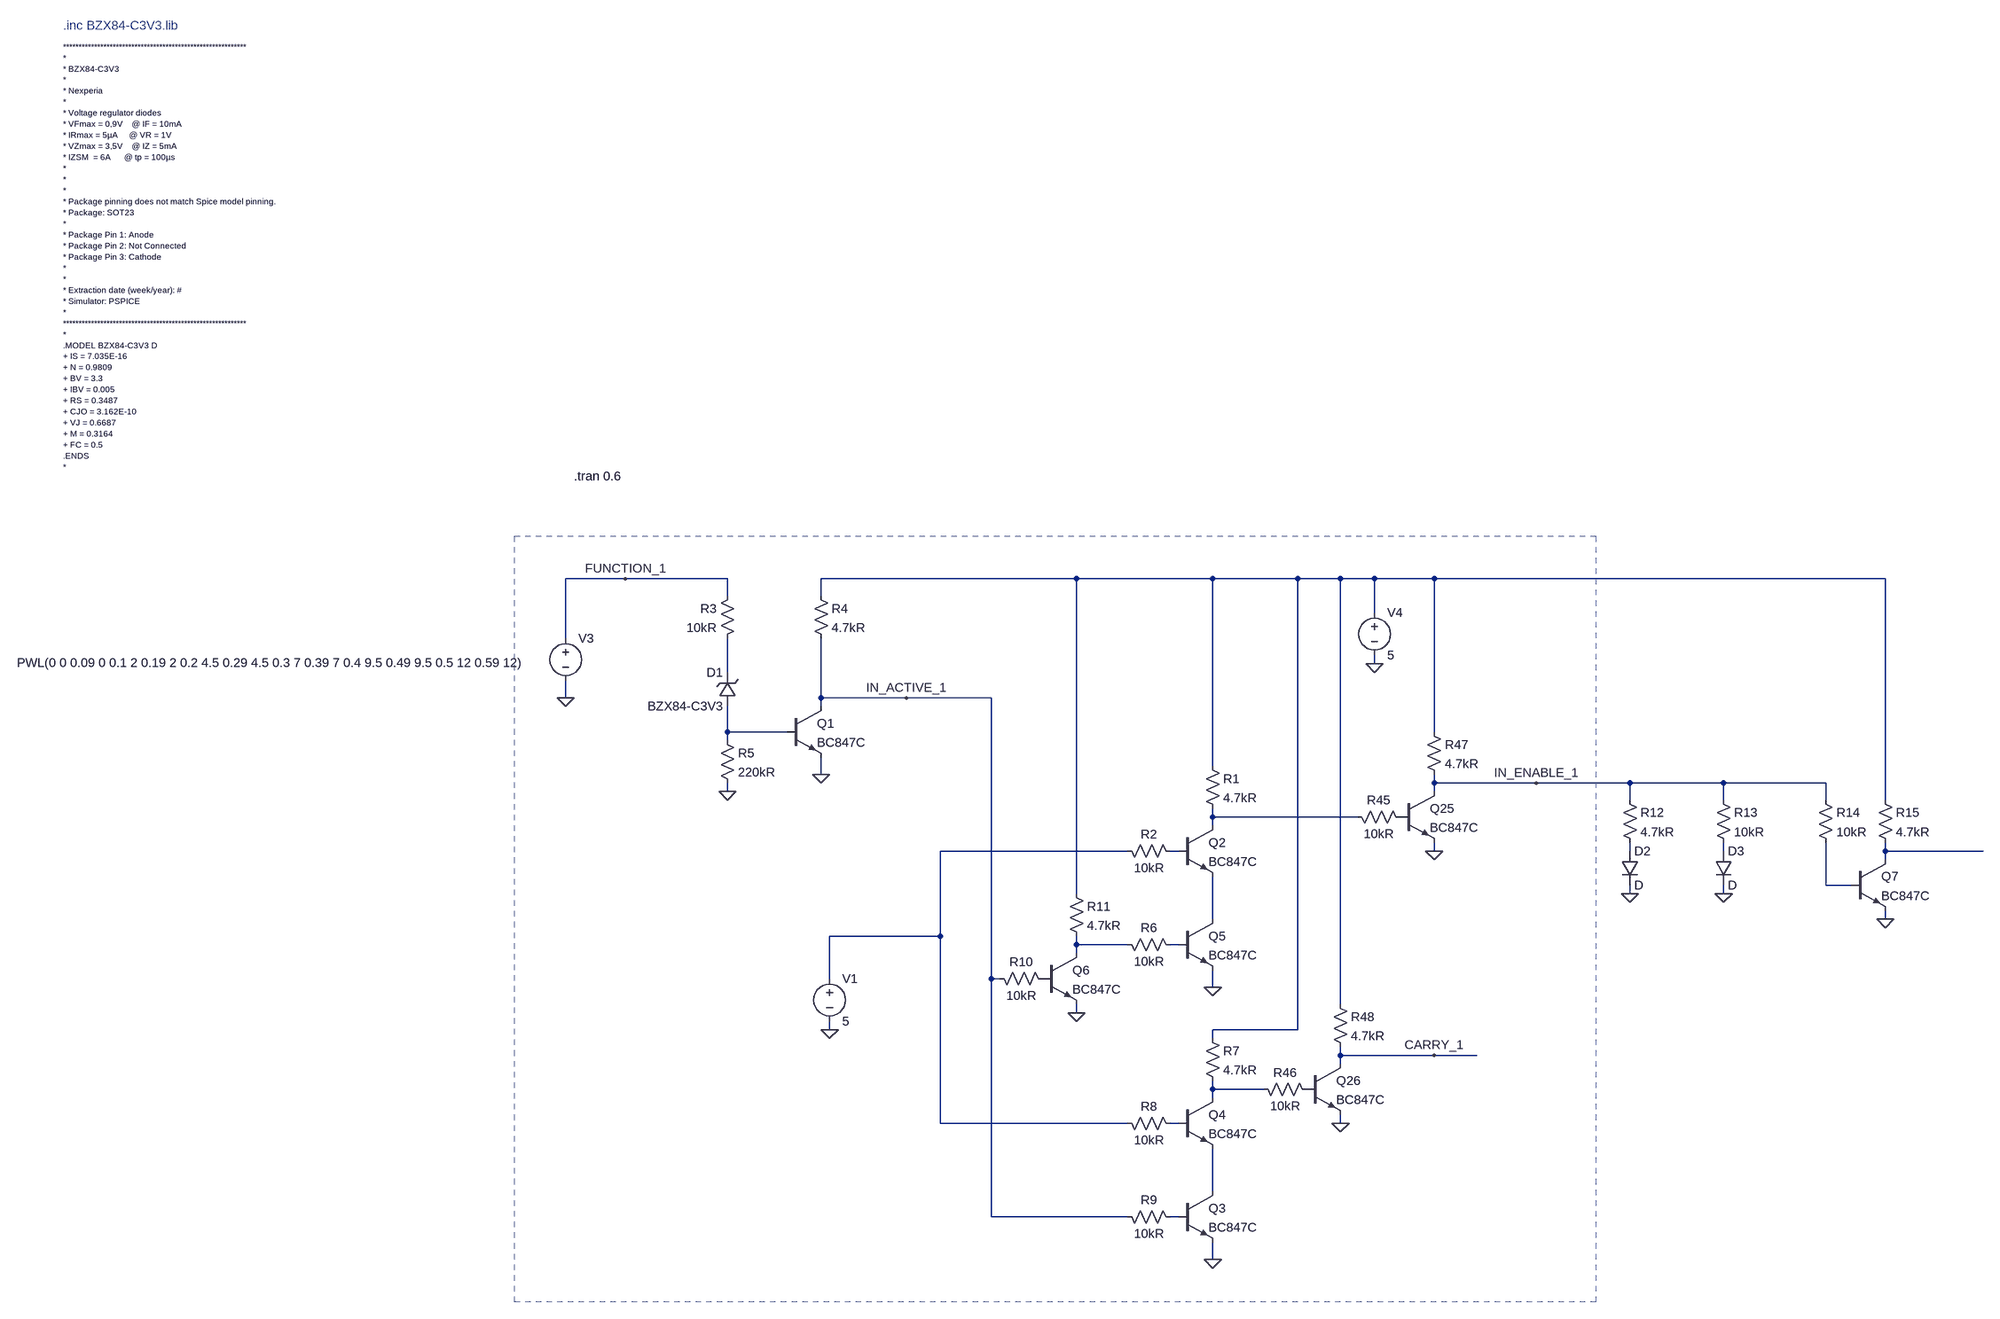
[diagram p0: schematic Source_selection.asc]
Source_selection.asc, the LTspice schematic file:
Version 4
SHEET 1 2756 6068
WIRE 160 -592 48 -592
WIRE 352 -592 160 -592
WIRE 1008 -592 528 -592
WIRE 1264 -592 1008 -592
WIRE 1424 -592 1264 -592
WIRE 1504 -592 1424 -592
WIRE 1568 -592 1504 -592
WIRE 1680 -592 1568 -592
WIRE 2528 -592 1680 -592
WIRE 352 -560 352 -592
WIRE 528 -560 528 -592
WIRE 1568 -528 1568 -592
WIRE 48 -480 48 -592
WIRE 1568 -432 1568 -448
WIRE 352 -416 352 -480
WIRE 48 -368 48 -400
WIRE 528 -368 528 -480
WIRE 688 -368 528 -368
WIRE 848 -368 688 -368
WIRE 528 -352 528 -368
WIRE 352 -304 352 -352
WIRE 464 -304 352 -304
WIRE 1680 -304 1680 -592
WIRE 352 -288 352 -304
WIRE 1264 -240 1264 -592
WIRE 528 -224 528 -256
WIRE 1680 -208 1680 -224
WIRE 1872 -208 1680 -208
WIRE 2048 -208 1872 -208
WIRE 2224 -208 2048 -208
WIRE 2416 -208 2224 -208
WIRE 352 -192 352 -208
WIRE 1680 -192 1680 -208
WIRE 2048 -176 2048 -208
WIRE 2224 -176 2224 -208
WIRE 2416 -176 2416 -208
WIRE 2528 -176 2528 -592
WIRE 1264 -144 1264 -160
WIRE 1536 -144 1264 -144
WIRE 1264 -128 1264 -144
WIRE 1104 -80 752 -80
WIRE 1200 -80 1184 -80
WIRE 1680 -80 1680 -96
WIRE 2048 -80 2048 -96
WIRE 2224 -80 2224 -96
WIRE 2528 -80 2528 -96
WIRE 2752 -80 2528 -80
WIRE 2528 -64 2528 -80
WIRE 2416 -16 2416 -96
WIRE 2464 -16 2416 -16
WIRE 1008 0 1008 -592
WIRE 2048 0 2048 -16
WIRE 2224 0 2224 -16
WIRE 1264 48 1264 -32
WIRE 2528 48 2528 32
WIRE 752 80 752 -80
WIRE 752 80 544 80
WIRE 1008 96 1008 80
WIRE 1104 96 1008 96
WIRE 1200 96 1184 96
WIRE 1008 112 1008 96
WIRE 544 160 544 80
WIRE 848 160 848 -368
WIRE 864 160 848 160
WIRE 1264 176 1264 144
WIRE 1504 208 1504 -592
WIRE 1008 224 1008 208
WIRE 544 256 544 240
WIRE 1424 256 1424 -592
WIRE 1424 256 1264 256
WIRE 1264 272 1264 256
WIRE 1504 304 1504 288
WIRE 1680 304 1504 304
WIRE 1760 304 1680 304
WIRE 1504 320 1504 304
WIRE 1264 368 1264 352
WIRE 1360 368 1264 368
WIRE 1264 384 1264 368
WIRE 752 432 752 80
WIRE 1104 432 752 432
WIRE 1200 432 1184 432
WIRE 1504 432 1504 416
WIRE 1264 560 1264 480
WIRE 848 608 848 160
WIRE 1104 608 848 608
WIRE 1200 608 1184 608
WIRE 1264 688 1264 656
FLAG 528 -224 0
FLAG 48 -368 0
FLAG 1568 -432 0
FLAG 160 -592 FUNCTION_1
FLAG 352 -192 0
FLAG 1264 176 0
FLAG 1264 688 0
FLAG 688 -368 IN_ACTIVE_1
FLAG 1872 -208 IN_ENABLE_1
FLAG 1680 304 CARRY_1
FLAG 544 256 0
FLAG 1504 432 0
FLAG 1680 -80 0
FLAG 1008 224 0
FLAG 2048 0 0
FLAG 2224 0 0
FLAG 2528 48 0
SYMBOL npn 464 -352 R0
SYMATTR InstName Q1
SYMATTR Value BC847C
SYMBOL res 368 -576 M0
SYMATTR InstName R3
SYMATTR Value 10kR
SYMBOL voltage 48 -496 R0
WINDOW 123 0 0 Left 0
WINDOW 39 0 0 Left 0
WINDOW 3 -1031 62 Left 2
SYMATTR Value PWL(0 0 0.09 0 0.1 2 0.19 2 0.2 4.5 0.29 4.5 0.3 7 0.39 7 0.4 9.5 0.49 9.5 0.5 12 0.59 12)
SYMATTR InstName V3
SYMBOL res 512 -576 R0
SYMATTR InstName R4
SYMATTR Value 4.7kR
SYMBOL voltage 1568 -544 R0
WINDOW 123 0 0 Left 0
WINDOW 39 0 0 Left 0
SYMATTR InstName V4
SYMATTR Value 5
SYMBOL zener 368 -352 R180
WINDOW 0 24 64 Left 2
WINDOW 3 24 0 Left 2
SYMATTR InstName D1
SYMATTR Value BZX84-C3V3
SYMBOL res 336 -304 R0
SYMATTR InstName R5
SYMATTR Value 220kR
SYMBOL npn 1200 -128 R0
SYMATTR InstName Q2
SYMATTR Value BC847C
SYMBOL npn 1200 560 R0
SYMATTR InstName Q3
SYMATTR Value BC847C
SYMBOL res 1248 -256 R0
SYMATTR InstName R1
SYMATTR Value 4.7kR
SYMBOL res 1200 -64 M270
WINDOW 0 32 56 VTop 2
WINDOW 3 0 56 VBottom 2
SYMATTR InstName R2
SYMATTR Value 10kR
SYMBOL res 1200 112 M270
WINDOW 0 32 56 VTop 2
WINDOW 3 0 56 VBottom 2
SYMATTR InstName R6
SYMATTR Value 10kR
SYMBOL npn 1200 384 R0
SYMATTR InstName Q4
SYMATTR Value BC847C
SYMBOL res 1248 256 R0
SYMATTR InstName R7
SYMATTR Value 4.7kR
SYMBOL res 1200 448 M270
WINDOW 0 32 56 VTop 2
WINDOW 3 0 56 VBottom 2
SYMATTR InstName R8
SYMATTR Value 10kR
SYMBOL res 1200 624 M270
WINDOW 0 32 56 VTop 2
WINDOW 3 0 56 VBottom 2
SYMATTR InstName R9
SYMATTR Value 10kR
SYMBOL voltage 544 144 R0
WINDOW 123 0 0 Left 0
WINDOW 39 0 0 Left 0
SYMATTR InstName V1
SYMATTR Value 5
SYMBOL npn 1440 320 R0
SYMATTR InstName Q26
SYMATTR Value BC847C
SYMBOL res 1456 384 M270
WINDOW 0 32 56 VTop 2
WINDOW 3 0 56 VBottom 2
SYMATTR InstName R46
SYMATTR Value 10kR
SYMBOL res 1488 192 R0
SYMATTR InstName R48
SYMATTR Value 4.7kR
SYMBOL npn 1616 -192 R0
SYMATTR InstName Q25
SYMATTR Value BC847C
SYMBOL res 1632 -128 M270
WINDOW 0 32 56 VTop 2
WINDOW 3 0 56 VBottom 2
SYMATTR InstName R45
SYMATTR Value 10kR
SYMBOL res 1664 -320 R0
SYMATTR InstName R47
SYMATTR Value 4.7kR
SYMBOL npn 1200 48 R0
SYMATTR InstName Q5
SYMATTR Value BC847C
SYMBOL npn 944 112 R0
SYMATTR InstName Q6
SYMATTR Value BC847C
SYMBOL res 960 176 M270
WINDOW 0 32 56 VTop 2
WINDOW 3 0 56 VBottom 2
SYMATTR InstName R10
SYMATTR Value 10kR
SYMBOL res 992 -16 R0
SYMATTR InstName R11
SYMATTR Value 4.7kR
SYMBOL diode 2032 -80 R0
SYMATTR InstName D2
SYMBOL res 2032 -192 R0
SYMATTR InstName R12
SYMATTR Value 4.7kR
SYMBOL diode 2208 -80 R0
SYMATTR InstName D3
SYMBOL res 2208 -192 R0
SYMATTR InstName R13
SYMATTR Value 10kR
SYMBOL npn 2464 -64 R0
SYMATTR InstName Q7
SYMATTR Value BC847C
SYMBOL res 2512 -192 R0
SYMATTR InstName R15
SYMATTR Value 4.7kR
SYMBOL res 2400 -192 R0
SYMATTR InstName R14
SYMATTR Value 10kR
TEXT 64 -848 Left 2 !.tran 0.6
TEXT -896 -1656 Left 1 !***********************************************************\n*\n* BZX84-C3V3\n*\n* Nexperia\n*\n* Voltage regulator diodes\n* VFmax = 0,9V    @ IF = 10mA\n* IRmax = 5µA     @ VR = 1V\n* VZmax = 3,5V    @ IZ = 5mA\n* IZSM  = 6A      @ tp = 100µs\n*\n*\n*\n* Package pinning does not match Spice model pinning.\n* Package: SOT23\n*\n* Package Pin 1: Anode\n* Package Pin 2: Not Connected\n* Package Pin 3: Cathode\n*\n*\n* Extraction date (week/year): #\n* Simulator: PSPICE\n*\n***********************************************************\n*\n.MODEL BZX84-C3V3 D\n+ IS = 7.035E-16\n+ N = 0.9809\n+ BV = 3.3\n+ IBV = 0.005\n+ RS = 0.3487\n+ CJO = 3.162E-10\n+ VJ = 0.6687\n+ M = 0.3164\n+ FC = 0.5\n.ENDS\n*
TEXT -896 -1696 Left 2 ;.inc BZX84-C3V3.lib
RECTANGLE Normal 1984 768 -48 -672 2

The netlist it stands for:
* Source_selection.asc
Q1 IN_ACTIVE_1 N003 0 0 BC847C
R3 FUNCTION_1 N002 10kR
V3 FUNCTION_1 0 PWL(0 0 0.09 0 0.1 2 0.19 2 0.2 4.5 0.29 4.5 0.3 7 0.39 7 0.4 9.5 0.49 9.5 0.5 12 0.59 12)
R4 N001 IN_ACTIVE_1 4.7kR
V4 N001 0 5
D1 N003 N002 BZX84-C3V3
R5 N003 0 220kR
Q2 N004 N006 N011 0 BC847C
Q3 N016 N017 0 0 BC847C
R1 N001 N004 4.7kR
R2 N006 N005 10kR
R6 N013 N012 10kR
Q4 N014 N015 N016 0 BC847C
R7 N001 N014 4.7kR
R8 N015 N005 10kR
R9 N017 IN_ACTIVE_1 10kR
V1 N005 0 5
Q26 CARRY_1 P001 0 0 BC847C
R46 P001 N014 10kR
R48 N001 CARRY_1 4.7kR
Q25 IN_ENABLE_1 P002 0 0 BC847C
R45 P002 N004 10kR
R47 N001 IN_ENABLE_1 4.7kR
Q5 N011 N013 0 0 BC847C
Q6 N012 P003 0 0 BC847C
R10 P003 IN_ACTIVE_1 10kR
R11 N001 N012 4.7kR
D2 N007 0 D
R12 IN_ENABLE_1 N007 4.7kR
D3 N008 0 D
R13 IN_ENABLE_1 N008 10kR
Q7 N009 N010 0 0 BC847C
R15 N001 N009 4.7kR
R14 IN_ENABLE_1 N010 10kR
.model D D
.lib standard.dio
.model NPN NPN
.model PNP PNP
.lib standard.bjt
.tran 0.6
***********************************************************
*
* BZX84-C3V3
*
* Nexperia
*
* Voltage regulator diodes
* VFmax = 0,9V    @ IF = 10mA
* IRmax = 5µA     @ VR = 1V
* VZmax = 3,5V    @ IZ = 5mA
* IZSM  = 6A      @ tp = 100µs
*
*
*
* Package pinning does not match Spice model pinning.
* Package: SOT23
*
* Package Pin 1: Anode
* Package Pin 2: Not Connected
* Package Pin 3: Cathode
*
*
* Extraction date (week/year): #
* Simulator: PSPICE
*
***********************************************************
*
.MODEL BZX84-C3V3 D
+ IS = 7.035E-16
+ N = 0.9809
+ BV = 3.3
+ IBV = 0.005
+ RS = 0.3487
+ CJO = 3.162E-10
+ VJ = 0.6687
+ M = 0.3164
+ FC = 0.5
.ENDS
*
* .inc BZX84-C3V3.lib
.backanno
.end